# Altium schematic sheet Supply_3V3.SchDoc
size A; SheetNumber: 6; SheetTotal: 9
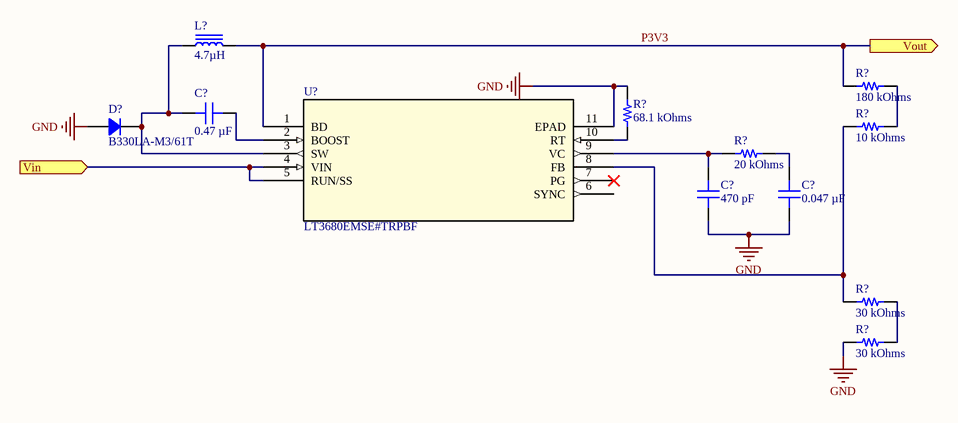
[diagram p0: Supply_3V3.SchDoc]

## Parts
(Parts that share a designator on the sheet are numbered #1, #2 ... from top to bottom, then left to right.)
C?#1  0.47 µF  [CAP 0805_2012]
C?#2  470 pF  [CAP 0805_2012]
C?#3  0.047 µF  [CAP 0805_2012]
D?  B330LA-M3/61T  [DO214AC SMA]
L?  4.7µH  [TDK SPM3012-LR]
R?#1  180 kOhms  [RES 0805_2012]
R?#2  68.1 kOhms  [RES 0805_2012]
R?#3  10 kOhms  [RES 0805_2012]
R?#4  20 kOhms  [RES 0805_2012]
R?#5  30 kOhms  [RES 0805_2012]
R?#6  30 kOhms  [RES 0805_2012]
U?  LT3680EMSE#TRPBF  [MSOP-10_MSE_LIT]

## Ports
Vin (in), Vout (out)

## Nets
GND: C?#2.1 C?#3.2 D?.1 R?#2.2 R?#6.2 U?.11(EPAD)
P3V3: L?.2 R?#1.2 U?.1(BD) ; port Vout
Vin: U?.4(VIN) U?.5(RUN/SS) ; port Vin
NetC?#1_1: C?#1.1 D?.2 L?.1 U?.3(SW)
NetC?#1_2: C?#1.2 U?.2(BOOST)
NetC?#2_2: C?#2.2 R?#4.1 U?.9(VC)
NetC?#3_1: C?#3.1 R?#4.2
NetR?#1_1: R?#1.1 R?#3.1
NetR?#2_1: R?#2.1 U?.10(RT)
NetR?#3_2: R?#3.2 R?#5.2 U?.8(FB)
NetR?#5_1: R?#5.1 R?#6.1

Not connected (* = marked no-connect by the designer): U? 6(SYNC) 7(PG)*

## Library data of the parts
C?#1 = C0805C474K5RACAUTO7210: CAP CER 0.47UF 50V X7R 0805; manufacturer: KEMET; Tolerance: ±10%; Part Number: C0805C474K5RACAUTO7210; Value: 0.47 µF; Applications: Automotive, Bypass, Decoupling; Capacitance: 0.47 µF; componentlink1description: Datasheet; componentlink1url: https://connect.kemet.com:7667/gateway/IntelliData-ComponentDocumentation/1.0/download/datasheet/C0805C474K5RACAUTO7210; componentlink2description: DigiKey Link; componentlink2url: https://www.digikey.com/en/products/detail/kemet/C0805C474K5RACAUTO7210/11673924; Device Package: 0805 (2012 Metric); lastupdated: 6/3/2023 7:15:48 PM; Lifecycle Status: Active; Minimum Order: 1; Mounting Type: Surface Mount, MLCC; Operating Temperature: -55°C ~ 125°C; Package / Case: 0805 (2012 Metric); packaging: TapeAndReel; partid: 50121; Part Status: Active; price: 0.05; Ratings: AEC-Q200; series: SMD Auto X7R; Size / Dimension: 0.079" L x 0.049" W (2.00mm x 1.25mm); Supplier 1: DigiKey; Supplier Part Number 1: 399-C0805C474K5RACAUTO7210CT-ND; Temperature Coefficient: X7R; Thickness (Max): 0.043" (1.10mm); Voltage - Rated: 50V
C?#2 = C0805S471K5RACAUTO: CAP CER 470PF 50V X7R 0805; manufacturer: KEMET; Tolerance: ±10%; Part Number: C0805S471K5RACAUTO; Value: 470 pF; Applications: Automotive; Capacitance: 470 pF; componentlink1description: Datasheet; componentlink1url: https://api.kemet.com/component-edge/download/datasheet/C0805S471K5RACAUTO.pdf; componentlink2description: DigiKey Link; componentlink2url: https://www.digikey.com/en/products/detail/kemet/C0805S471K5RACAUTO/9742175; Device Package: 0805 (2012 Metric); Features: Floating Electrode; lastupdated: 6/3/2023 7:17:29 PM; Lifecycle Status: Active; Minimum Order: 1; Mounting Type: Surface Mount, MLCC; Operating Temperature: -55°C ~ 125°C; Package / Case: 0805 (2012 Metric); packaging: TapeAndReel; partid: 2648; Part Status: Active; price: 0.05; Ratings: AEC-Q200; series: SMD Auto X7R FE; Size / Dimension: 0.079" L x 0.049" W (2.00mm x 1.25mm); Supplier 1: DigiKey; Supplier Part Number 1: 399-19424-1-ND; Temperature Coefficient: X7R; Thickness (Max): 0.035" (0.88mm); Voltage - Rated: 50V
C?#3 = C0805X473J2RECAUTO7210: CAP CER 0805 47NF 200V X7R 5%; manufacturer: KEMET; Part Number: C0805X473J2RECAUTO7210; Value: 0.047 µF; Applications: Automotive, Boardflex Sensitive, ESD Protection; Capacitance: 0.047 µF; componentlink1description: Datasheet; componentlink1url: https://connect.kemet.com:7667/gateway/IntelliData-ComponentDocumentation/1.0/download/datasheet/C0805X473J2RECAUTO7210; componentlink2description: DigiKey Link; componentlink2url: https://www.digikey.com/en/products/detail/kemet/C0805X473J2RECAUTO7210/8654579; Device Package: 0805 (2012 Metric); Features: Soft Termination; lastupdated: 6/3/2023 7:15:59 PM; Lifecycle Status: Active; Minimum Order: 1; Mounting Type: Surface Mount, MLCC; Operating Temperature: -55°C ~ 125°C; Package / Case: 0805 (2012 Metric); packaging: TapeAndReel; partid: 48834; Part Status: Active; price: 0.13; Ratings: AEC-Q200; series: ESD SMD Auto X7R; Size / Dimension: 0.079" L x 0.049" W (2.00mm x 1.25mm); Supplier 1: DigiKey; Supplier Part Number 1: 399-C0805X473J2RECAUTO7210CT-ND; Temperature Coefficient: X7R; Thickness (Max): 0.057" (1.45mm); Tolerance: ±5%; Voltage - Rated: 200V
D? = B330LA-M3/61T: DIODE SCHOTTKY 30V 3A DO214AC; Manufacturer: Vishay Semiconductor Diodes Division; Current - Reverse Leakage @ Vr: 500µA @ 30V; Speed: Fast Recovery =< 500ns, > 200mA (Io); Voltage - Forward (Vf) (Max) @ If: 500mV @ 3A; Part Number: B330LA-M3/61T; ComponentLink1Description: Datasheet; ComponentLink1URL: http://www.vishay.com/docs/89415/b330la.pdf; ComponentLink2Description: DigiKey Link; ComponentLink2URL: http://digikey.com/product-detail/en/vishay-semiconductor-diodes-division/B330LA-M3-61T/B330LA-M3-61TGICT-ND/9600408; Current - Average Rectified (Io): 3A; Diode Type: Schottky; LastUpdated: 6/3/2023 8:19:37 PM; Lifecycle Status: Active; Minimum Order: 1; Mounting Type: Surface Mount; Operating Temperature - Junction: -65°C ~ 150°C; Package / Case: DO-214AC, SMA; Packaging: TapeAndReel; PartId: 2191; Part Status: Active; Price: 0.17; Series: -; Supplier 1: DigiKey; Supplier Part Number 1: B330LA-M3/61TGICT-ND; Supplier Device Package: DO-214AC (SMA); Voltage - DC Reverse (Vr) (Max): 30V
L? = SPM3015T-4R7M-LR: FIXED IND 4.7UH 1.8A 199.1 MOHM; Manufacturer: TDK Corporation; Current - Saturation: 3A; DC Resistance (DCR): 199.1mOhm Max; Inductance Frequency - Test: 100kHz; Material - Core: Metal; Shielding: Shielded; Tolerance: ±20%; Type: Wirewound; Part Number: SPM3015T-4R7M-LR; ComponentLink1Description: Datasheet; ComponentLink1URL: https://product.tdk.com/info/en/catalog/datasheets/inductor_commercial_power_spm3015-lr_en.pdf?ref_disty=digikey; ComponentLink2Description: DigiKey Link; ComponentLink2URL: http://digikey.com/product-detail/en/tdk-corporation/SPM3015T-4R7M-LR/445-174451-1-ND/5962377; Current Rating (Amps): 1.8A; Device Package: Nonstandard; Height - Seated (Max): 0.047" (1.20mm); Inductance: 4.7µH; LastUpdated: 9/2/2020 1:22:14 AM; Lifecycle Status: Active; Minimum Order: 1; Mounting Type: Surface Mount; Operating Temperature: -40°C ~ 125°C; Package / Case: Nonstandard; Packaging: TapeAndReel; PartId: 139; Part Status: Active; Price: 0.59; Series: SPM-LR; Size / Dimension: 0.126" L x 0.118" W (3.20mm x 3.00mm); Supplier 1: DigiKey; Supplier Part Number 1: 445-174451-1-ND; Value: 4.7µH
R?#1 = RMCF0805FT180K: RES 180K OHM 1% 1/8W 0805; Manufacturer: Stackpole Electronics Inc; Power (Watts): 0.125W, 1/8W; Temperature Coefficient: ±100ppm/°C; Part Number: RMCF0805FT180K; Value: 180 kOhms; ComponentLink1Description: Datasheet; ComponentLink1URL: https://www.seielect.com/catalog/sei-rmcf_rmcp.pdf; ComponentLink2Description: DigiKey Link; ComponentLink2URL: https://www.digikey.com/en/products/detail/stackpole-electronics-inc/RMCF0805FT180K/1712759; Composition: Thick Film; Device Package: 0805 (2012 Metric); Features: Automotive AEC-Q200; Height - Seated (Max): 0.026" (0.65mm); LastUpdated: 6/3/2023 7:56:02 PM; Lifecycle Status: Active; Minimum Order: 1; Number of Terminations: 2; Operating Temperature: -55°C ~ 155°C; Package / Case: 0805 (2012 Metric); Packaging: CutTape; PartId: 49692; Part Status: Active; Price: 0.01; Ratings: AEC-Q200; Resistance: 180 kOhms; Series: RMCF; Size / Dimension: 0.079" L x 0.049" W (2.00mm x 1.25mm); Supplier 1: DigiKey; Supplier Part Number 1: 738-RMCF0805FT180KCT-ND; Supplier Device Package: 0805; Tolerance: ±1%
R?#2 = CRCW080568K1FKEB: RES SMD 68.1K OHM 1% 1/8W 0805; Manufacturer: Vishay Dale; Power (Watts): 0.125W, 1/8W; Temperature Coefficient: ±100ppm/°C; Part Number: CRCW080568K1FKEB; Value: 68.1 kOhms; ComponentLink1Description: Datasheet; ComponentLink1URL: http://www.vishay.com/docs/20035/dcrcwe3.pdf; ComponentLink2Description: DigiKey Link; ComponentLink2URL: https://www.digikey.com/en/products/detail/vishay-dale/CRCW080568K1FKEB/5075851; Composition: Thick Film; Device Package: 0805 (2012 Metric); Features: Automotive AEC-Q200; Height - Seated (Max): 0.020" (0.50mm); LastUpdated: 6/3/2023 7:55:59 PM; Lifecycle Status: Active; Minimum Order: 1; Number of Terminations: 2; Operating Temperature: -55°C ~ 155°C; Package / Case: 0805 (2012 Metric); Packaging: TapeAndReel; PartId: 57206; Part Status: Active; Price: 0.01; Ratings: AEC-Q200; Resistance: 68.1 kOhms; Series: CRCW; Size / Dimension: 0.079" L x 0.049" W (2.00mm x 1.25mm); Supplier 1: DigiKey; Supplier Part Number 1: 541-CRCW080568K1FKEBCT-ND; Supplier Device Package: 0805; Tolerance: ±1%
R?#3 = CRCW080510K0FKEA: RES SMD 10K OHM 1% 1/8W 0805; Manufacturer: Vishay Dale; Power (Watts): 0.125W, 1/8W; Temperature Coefficient: ±100ppm/°C; Part Number: CRCW080510K0FKEA; Value: 10 kOhms; ComponentLink1Description: Datasheet; ComponentLink1URL: http://www.vishay.com/docs/20035/dcrcwe3.pdf; ComponentLink2Description: DigiKey Link; ComponentLink2URL: https://www.digikey.com/en/products/detail/vishay-dale/CRCW080510K0FKEA/1175751; Composition: Thick Film; Device Package: 0805 (2012 Metric); Features: Automotive AEC-Q200; Height - Seated (Max): 0.020" (0.50mm); LastUpdated: 6/3/2023 7:57:45 PM; Lifecycle Status: Active; Minimum Order: 1; Number of Terminations: 2; Operating Temperature: -55°C ~ 155°C; Package / Case: 0805 (2012 Metric); Packaging: TapeAndReel; PartId: 28101; Part Status: Active; Price: 0.01; Ratings: AEC-Q200; Resistance: 10 kOhms; Series: CRCW; Size / Dimension: 0.079" L x 0.049" W (2.00mm x 1.25mm); Supplier 1: DigiKey; Supplier Part Number 1: 541-10.0KCCT-ND; Supplier Device Package: 0805; Tolerance: ±1%
R?#4 = CRCW080520K0FKEAHP: RES SMD 20K OHM 1% 1/2W 0805; Manufacturer: Vishay Dale; Power (Watts): 0.5W, 1/2W; Temperature Coefficient: ±100ppm/°C; Part Number: CRCW080520K0FKEAHP; Value: 20 kOhms; ComponentLink1Description: Datasheet; ComponentLink1URL: http://www.vishay.com/docs/20043/crcwhpe3.pdf; ComponentLink2Description: DigiKey Link; ComponentLink2URL: https://www.digikey.com/en/products/detail/vishay-dale/CRCW080520K0FKEAHP/2222356; Composition: Thick Film; Device Package: 0805 (2012 Metric); Features: Automotive AEC-Q200, Pulse Withstanding; Height - Seated (Max): 0.020" (0.50mm); LastUpdated: 6/3/2023 7:57:38 PM; Lifecycle Status: Active; Minimum Order: 1; Number of Terminations: 2; Operating Temperature: -55°C ~ 155°C; Package / Case: 0805 (2012 Metric); Packaging: TapeAndReel; PartId: 30339; Part Status: Active; Price: 0.02; Ratings: AEC-Q200; Resistance: 20 kOhms; Series: CRCW-HP; Size / Dimension: 0.079" L x 0.049" W (2.00mm x 1.25mm); Supplier 1: DigiKey; Supplier Part Number 1: 541-20.0KTCT-ND; Supplier Device Package: 0805; Tolerance: ±1%
R?#5 R?#6 = LTR10EZPF3002: RES SMD 30K OHM 1/4W 0805 WIDE; Manufacturer: Rohm Semiconductor; Power (Watts): 0.25W, 1/4W; Temperature Coefficient: ±100ppm/°C; Tolerance: ±1%; Part Number: LTR10EZPF3002; Value: 30 kOhms; ComponentLink1Description: Datasheet; ComponentLink1URL: https://www.rohm.com/datasheet/LTR100JZPD/ltr-e; ComponentLink2Description: DigiKey Link; ComponentLink2URL: https://www.digikey.com/en/products/detail/rohm-semiconductor/LTR10EZPF3002/4052901; Composition: Thick Film; Device Package: 0805 (2012 Metric); Features: Automotive AEC-Q200, Pulse Withstanding; Height - Seated (Max): 0.026" (0.65mm); LastUpdated: 6/3/2023 7:56:08 PM; Lifecycle Status: Active; Minimum Order: 1; Number of Terminations: 2; Operating Temperature: -55°C ~ 155°C; Package / Case: 0805 (2012 Metric); Packaging: TapeAndReel; PartId: 61920; Part Status: Active; Price: 0.04; Ratings: AEC-Q200; Resistance: 30 kOhms; Series: LTR; Size / Dimension: 0.047" L x 0.079" W (1.20mm x 2.00mm); Supplier 1: DigiKey; Supplier Part Number 1: RHM1214CT-ND; Supplier Device Package: 0805
U? = LT3680EMSE#TRPBF: No Description Available; Mfr_Name: Analog Devices Inc; RefDes: RefDes; Type: Type